# EAGLE design tone (EAGLE 8.5.0)
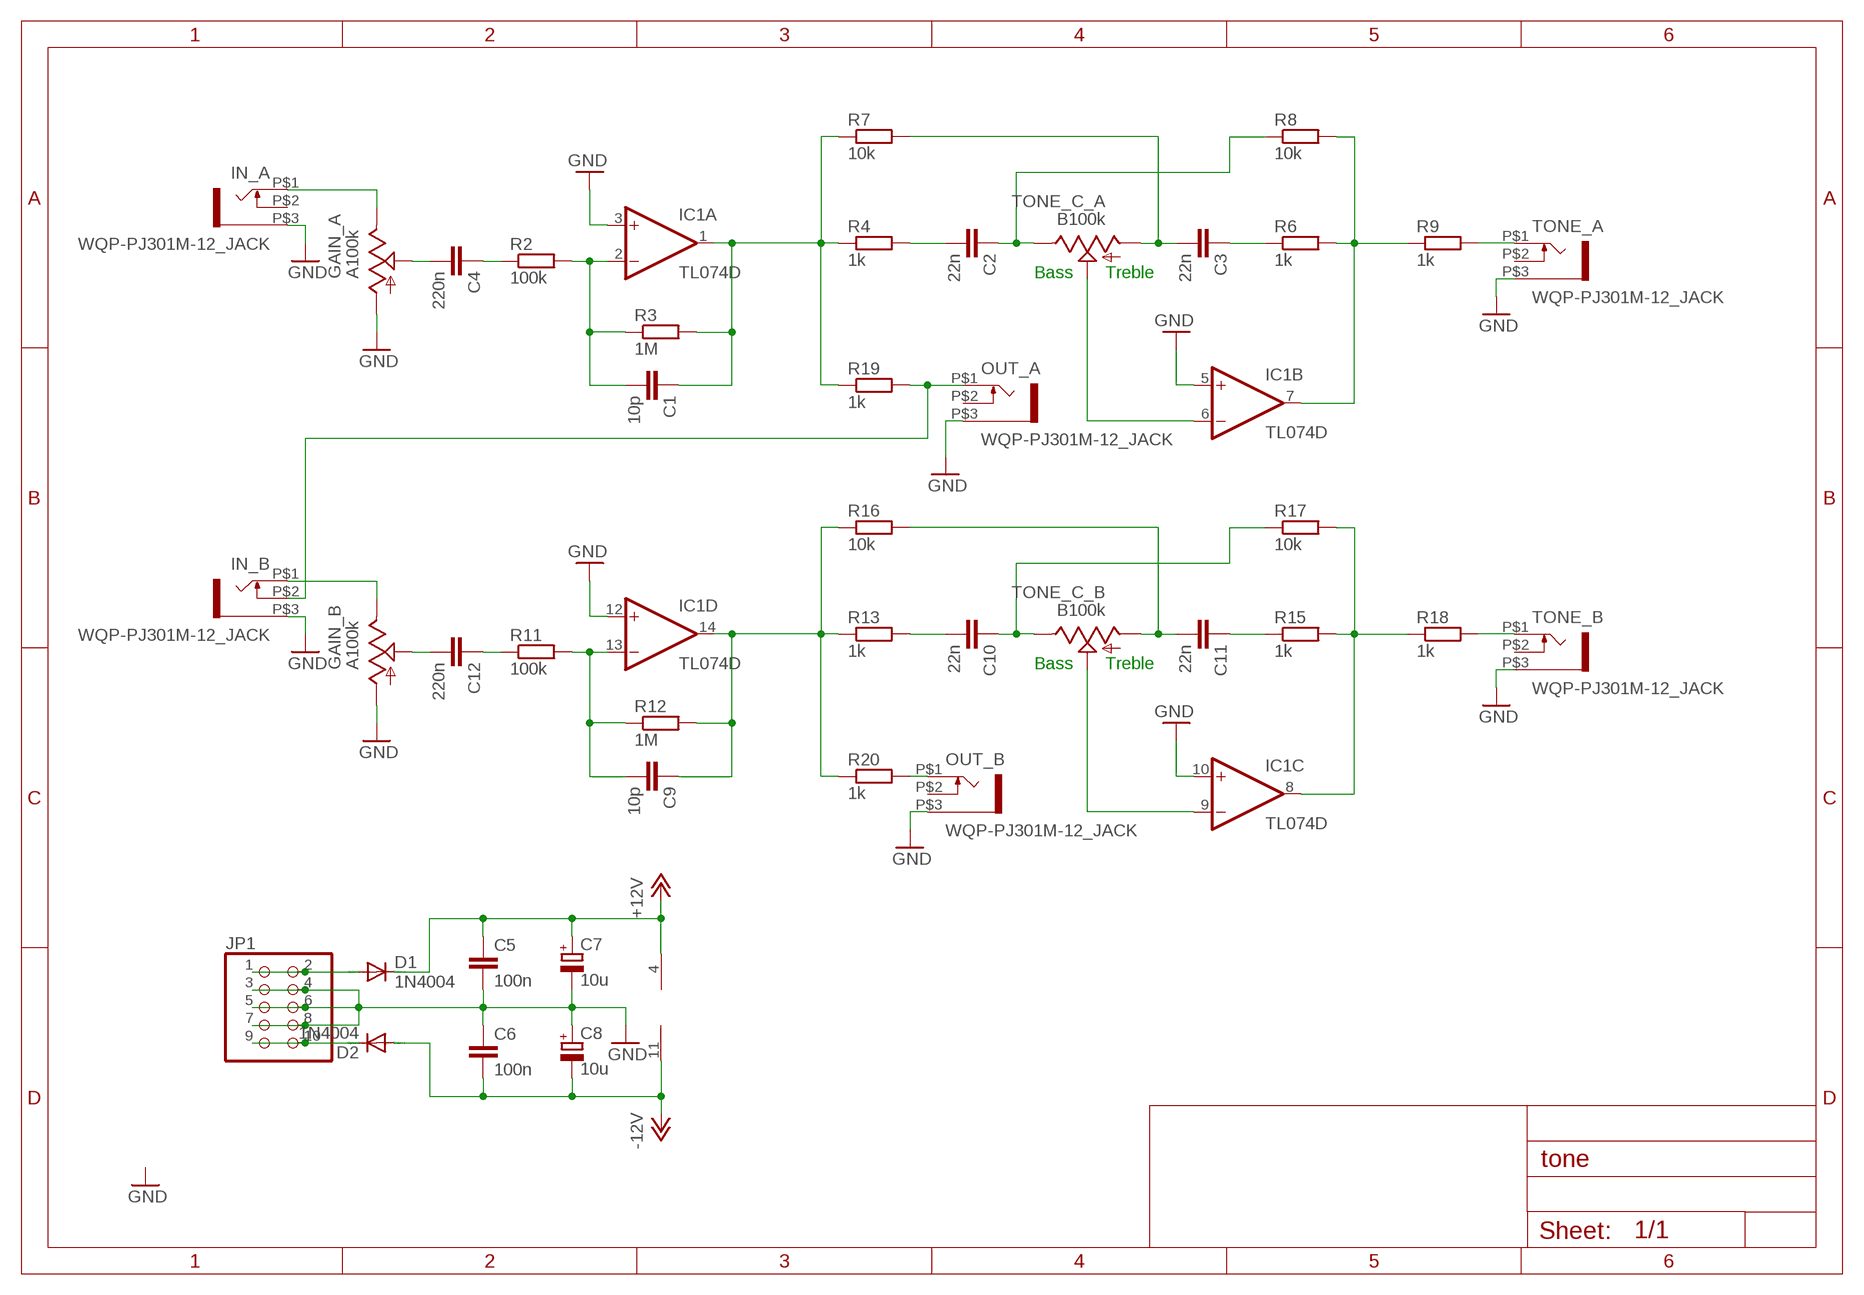
[diagram p0: schematic, sheet 1]

## Parts
C1  10p  C-EUC0603K  [C0603K]
C2  22n  C-EU050-025X075  [C050-025X075]
C3  22n  C-EU050-025X075  [C050-025X075]
C4  220n  C-EU050-025X075  [C050-025X075]
C5  100n  C-EU025-025X050  [C025-025X050]
C6  100n  C-EU025-025X050  [C025-025X050]
C7  10u  CPOL-EUE2.5-6  [E2,5-6]
C8  10u  CPOL-EUE2.5-6  [E2,5-6]
C9  10p  C-EUC0603K  [C0603K]
C10  22n  C-EU050-025X075  [C050-025X075]
C11  22n  C-EU050-025X075  [C050-025X075]
C12  220n  C-EU050-025X075  [C050-025X075]
D1  1N4004  [DO41-10]
D2  1N4004  [DO41-10]
GAIN_A  A100k  POT_USVERTICAL  [ALPS_POT_VERTICAL]
GAIN_B  A100k  POT_USVERTICAL  [ALPS_POT_VERTICAL]
IC1  TL074D  [SO14]
IN_A  WQP-PJ301M-12_JACK  [WQP-PJ301M-12_JACK]
IN_B  WQP-PJ301M-12_JACK  [WQP-PJ301M-12_JACK]
JP1  PINHD-2X5  [2X05]
OUT_A  WQP-PJ301M-12_JACK  [WQP-PJ301M-12_JACK]
OUT_B  WQP-PJ301M-12_JACK  [WQP-PJ301M-12_JACK]
R2  100k  R-EU_R0603  [R0603]
R3  1M  R-EU_R0603  [R0603]
R4  1k  R-EU_R0603  [R0603]
R6  1k  R-EU_R0603  [R0603]
R7  10k  R-EU_R0603  [R0603]
R8  10k  R-EU_R0603  [R0603]
R9  1k  R-EU_R0603  [R0603]
R11  100k  R-EU_R0603  [R0603]
R12  1M  R-EU_R0603  [R0603]
R13  1k  R-EU_R0603  [R0603]
R15  1k  R-EU_R0603  [R0603]
R16  10k  R-EU_R0603  [R0603]
R17  10k  R-EU_R0603  [R0603]
R18  1k  R-EU_R0603  [R0603]
R19  1k  R-EU_R0603  [R0603]
R20  1k  R-EU_R0603  [R0603]
TONE_A  WQP-PJ301M-12_JACK  [WQP-PJ301M-12_JACK]
TONE_B  WQP-PJ301M-12_JACK  [WQP-PJ301M-12_JACK]
TONE_C_A  B100k  POT_USVERTICAL  [ALPS_POT_VERTICAL]
TONE_C_B  B100k  POT_USVERTICAL  [ALPS_POT_VERTICAL]

## Nets
+12V: C5.1 C7.+ D1.C IC1.4(P:V+)
-12V: C6.2 C8.- D2.A IC1.11(P:V-)
GND: C5.2 C6.1 C7.- C8.+ GAIN_A.P$3(A) GAIN_B.P$3(A) IC1.3(A:+IN) IC1.5(B:+IN) IC1.10(C:+IN) IC1.12(D:+IN) IN_A.P$3 IN_B.P$3 JP1.3 JP1.4 JP1.5 JP1.6 JP1.7 JP1.8 OUT_A.P$3 OUT_B.P$3 TONE_A.P$3 TONE_B.P$3
N$1: C1.1 IC1.1(A:OUT) R3.2 R4.1 R7.1 R19.1
N$2: C4.2 GAIN_A.P$2(S)
N$3: C2.2 R4.2
N$4: C2.1 R8.1 TONE_C_A.P$1(E)
N$5: C3.2 R7.2 TONE_C_A.P$3(A)
N$6: C3.1 R6.1
N$7: IC1.7(B:OUT) R6.2 R8.2 R9.1
N$8: C4.1 R2.1
N$9: IC1.6(B:-IN) TONE_C_A.P$2(S)
N$10: C1.2 IC1.2(A:-IN) R2.2 R3.1
N$11: D1.A JP1.1 JP1.2
N$13: GAIN_A.P$1(E) IN_A.P$1
N$15: R9.2 TONE_A.P$1
N$18: D2.C JP1.9 JP1.10
N$20: C9.1 IC1.14(D:OUT) R12.2 R13.1 R16.1 R20.1
N$21: C10.2 R13.2
N$22: C10.1 R17.1 TONE_C_B.P$1(E)
N$23: C11.2 R16.2 TONE_C_B.P$3(A)
N$24: C11.1 R15.1
N$25: IC1.8(C:OUT) R15.2 R17.2 R18.1
N$26: C9.2 IC1.13(D:-IN) R11.2 R12.1
N$27: C12.2 GAIN_B.P$2(S)
N$28: C12.1 R11.1
N$29: GAIN_B.P$1(E) IN_B.P$1
N$30: R18.2 TONE_B.P$1
N$31: IC1.9(C:-IN) TONE_C_B.P$2(S)
N$32: IN_B.P$2 OUT_A.P$1 R19.2
N$33: OUT_B.P$1 R20.2
Unconnected: IN_A.P$2 OUT_A.P$2 OUT_B.P$2 TONE_A.P$2 TONE_B.P$2

## Notes on the sheet
- Bass | Treble
- Bass | Treble

## Library data of the parts
C1-C6 C9-C12 = rcl:C-EU: CAPACITOR, European symbol; SPICEPREFIX: C
C7 C8 = rcl:CPOL-EU: POLARIZED CAPACITOR, European symbol; SPICEPREFIX: C
D1 D2 = diode:1N4004: DIODE general purpose rectifier, 1 A
GAIN_A GAIN_B TONE_C_A TONE_C_B = pot-alps:POT_US
IC1 = linear:TL074: OP AMP
IN_A IN_B OUT_A OUT_B TONE_A TONE_B = thonkiconn:WQP-PJ301M-12_JACK
JP1 = pinhead:PINHD-2X5: PIN HEADER
R2-R4 R6-R9 R11-R13 R15-R20 = rcl:R-EU_: RESISTOR, European symbol

## Board
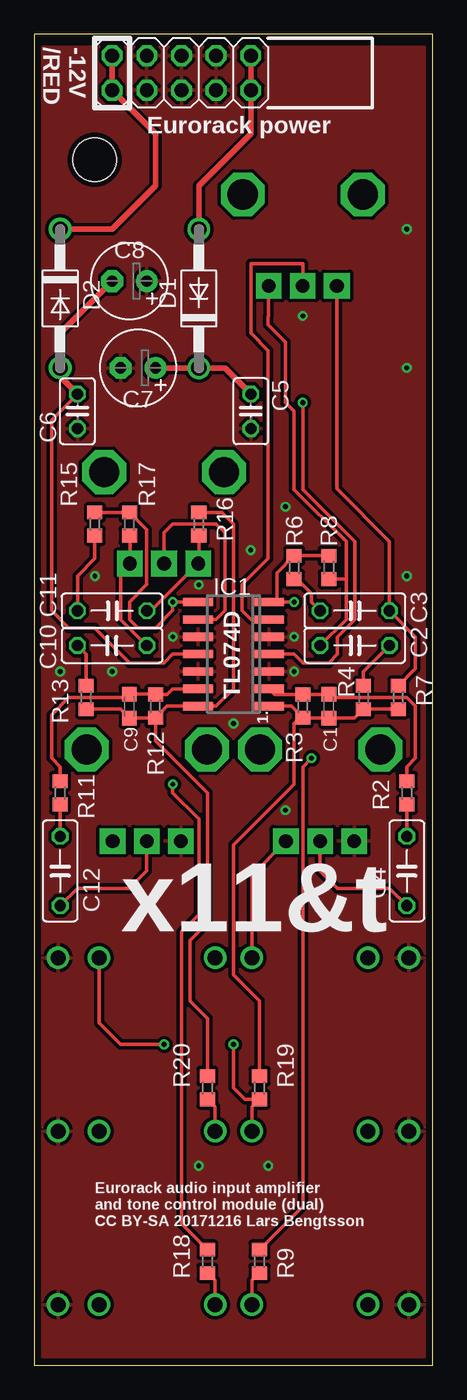
[diagram p1: board, top side]
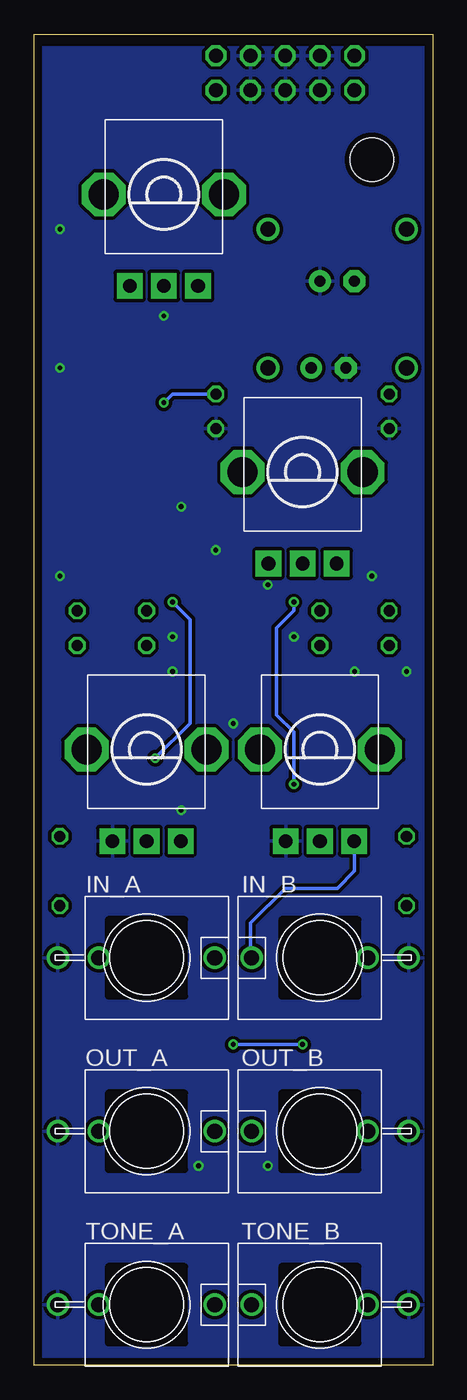
[diagram p2: board, bottom side, seen from below]

Size 29.19 x 97.46 mm. Coordinates in mm from the lower left corner, seen from the top.
Outline: 0,0 29.19,0 29.19,97.46 0,97.46 0,0
Copper layers (1*16): Top 0.0356mm / dielectric 1.5011mm / Bottom 0.0356mm
Design rules "Laen OSH Park PCBOrder": minimum track width 6mil, minimum drill 13mil, track to track 6mil, track to pad 6mil, pad to pad 6mil, via to via 6mil, smd to smd 6mil, copper to edge 15mil, drill to drill 6mil, minimum pad ring 7mil, minimum via ring 7mil, stop-mask expansion 3mil, vias tented up to drill 0mil, thermal gap 10mil
Holes 3.2 mm at 4.45,88.27

### Footprints (pad centres in the part's own frame; a part is rotated, then mirrored left to right if it is on the bottom)
C0603K = smd 1.05 x 1.08: 1 -0.875,0; 2 0.875,0
C050-025X075 = drill 0.813 octagon: 1 -2.54,0; 2 2.54,0
C025-025X050 = drill 0.813 octagon: 1 -1.27,0; 2 1.27,0
E2,5-6 = drill 0.813 pad 1.6: + -1.27,0 | drill 0.813 pad 1.6 octagon: - 1.27,0
DO41-10 = drill 1.118: A 5.08,0; C -5.08,0
ALPS_POT_VERTICAL = drill 1 pad 1.88 square: P$1 -2.5,6.7; P$2 0,6.7; P$3 2.5,6.7 | drill 2.2 pad 3.175 octagon: P$4 -4.4,0; P$5 4.4,0
SO14 = smd 0.6 x 2.2: 1 -3.81,-2.6; 2 -2.54,-2.6; 3 -1.27,-2.6; 4 0,-2.6; 5 1.27,-2.6; 6 2.54,-2.6; 7 3.81,-2.6; 8 3.81,2.6; 9 2.54,2.6; 10 1.27,2.6; 11 0,2.6; 12 -1.27,2.6; 13 -2.54,2.6; 14 -3.81,2.6
WQP-PJ301M-12_JACK = drill 1.1: P$1 0,5; P$2 0,-3.5; P$3 0,-6.5
2X05 = drill 1.016 octagon: 1 -5.08,-1.27; 2 -5.08,1.27; 3 -2.54,-1.27; 4 -2.54,1.27; 5 0,-1.27; 6 0,1.27; 7 2.54,-1.27; 8 2.54,1.27; 9 5.08,-1.27; 10 5.08,1.27
R0603 = smd 1 x 1.1: 1 -0.85,0; 2 0.85,0

### Placement (x,y rotation side)
C1  21.59,48.26 90 top
C2  23.49,52.71 0 top
C3  23.49,55.25 0 top
C4  27.3,36.2 270 top
C5  15.88,69.85 270 top
C6  3.17,69.85 90 top
C7  7.62,73.02 180 top
C8  6.99,79.38 180 top
C9  6.99,48.26 90 top
C10  5.71,52.71 180 top
C11  5.71,55.25 0 top
C12  1.91,36.2 270 top
D1  12.06,78.1 90 top
D2  1.91,78.1 270 top
GAIN_A  20.95,45.09 180 bottom
GAIN_B  8.26,45.09 180 bottom
IC1  14.61,52.07 90 top
IN_A  20.95,29.84 270 bottom
IN_B  8.26,29.84 90 bottom
JP1  10.79,94.61 180 top
OUT_A  20.95,17.14 270 bottom
OUT_B  8.26,17.14 90 bottom
R2  27.3,41.91 90 top
R3  19.68,48.26 270 top
R4  24.13,48.9 90 top
R6  19.05,58.42 90 top
R7  26.67,48.9 90 top
R8  21.59,58.42 90 top
R9  16.51,7.62 270 top
R11  1.91,41.91 90 top
R12  8.89,48.26 270 top
R13  3.81,48.9 90 top
R15  4.45,61.59 90 top
R16  12.06,61.59 270 top
R17  6.99,61.59 90 top
R18  12.7,7.62 270 top
R19  16.51,20.32 270 top
R20  12.7,20.32 270 top
TONE_A  20.95,4.45 270 bottom
TONE_B  8.26,4.45 90 bottom
TONE_C_A  19.68,85.72 180 bottom
TONE_C_B  9.53,65.41 180 bottom

### Tracks (layer width: path | path; a pad name or v marks a point on that pad's centre or on a via)
+12V  (via drill 0.35)
  Top 0.254: IC1.4 19.05,52.07 19.68,51.44 21.59,51.44 22.22,52.07 22.22,53.34 23.49,54.61 23.49,60.33 19.68,64.13 v19.68,70.48
  Top 0.406: C5.1 13.97,73.02 D1.C C7.+
  Bottom 0.254: C5.1 19.05,71.12 v19.68,70.48
-12V
  Top 0.254: IC1.11 10.16,52.07 9.53,51.44 6.99,51.44 4.45,53.98 2.54,53.98 1.27,55.25 1.27,69.21 C6.2
  Top 0.406: C6.2 1.91,72.39 D2.A 1.91,75.56 C8.-
GND  (via drill 0.35)
  other vias: 4.45,57.79 10.16,53.34 5.71,50.8 12.06,57.15 18.41,62.87 19.68,76.83 18.41,40.64 19.05,50.8 19.05,53.34 14.61,46.99 27.3,83.18 15.88,59.69 27.3,73.02 1.91,50.8 27.3,57.79 17.14,14.61 12.06,14.61
  pour Bottom (isolate 0.254): 0.64,96.52 28.57,96.52 28.57,0.64 0.64,0.64
  pour Top (isolate 0.254): 0.64,96.52 28.57,96.52 28.57,0.64 0.64,0.64
N$1
  Top 0.254: 17.78,48.26 arc73 IC1.1 18.83,48.26 R3.2 | R3.2 21.56,47.41 C1.1 23.47,47.39 R4.1 R7.1 | R19.1 16.51,26.67 14.61,28.57 14.61,38.1 19.05,42.55 19.05,46.99 19.47,47.41 R3.2
N$2
  Top 0.254: C4.2 26.04,34.93 22.22,34.93 20.95,36.2 GAIN_A.P$2
N$3
  Top 0.254: R4.2 24.13,50.8 C2.2
N$4
  Top 0.254: C2.1 22.86,54.61 22.86,57.15 22.86,57.57 | TONE_C_A.P$1 17.18,76.83 | 17.18,76.83 17.18,76.8 | 17.18,76.83 17.14,76.8 17.14,76.2 18.41,74.93 18.41,70.48 19.05,69.85 19.05,64.13 22.86,60.33 22.86,57.57 | R8.1 22.86,57.57
N$5
  Top 0.254: R7.2 27.94,51.02 27.94,53.34 C3.2 26.04,60.33 22.18,64.17 TONE_C_A.P$3
N$6
  Top 0.254: C3.1 20.32,55.88 20.32,56.52 19.26,57.57 R6.1
N$7  (via drill 0.35)
  Top 0.254: R9.1 19.68,11.64 19.68,43.82 v20.32,44.45 | IC1.7 17.78,55.88 | 17.78,55.88 v19.05,55.88 | R8.2 R6.2 17.78,58 17.78,55.88
  Bottom 0.254: v19.05,55.88 17.78,54.61 17.78,46.99 v20.32,44.45
N$8
  Top 0.254: C4.1 R2.1
N$9
  Top 0.254: IC1.6 15.88,54.61 15.24,55.25 15.24,57.15 17.14,59.05 17.14,74.3 15.88,75.56 15.88,80.64 19.68,80.64 TONE_C_A.P$2
N$10
  Top 0.254: R2.2 27.3,43.82 27.94,44.45 27.94,48.26 27.3,48.9 21.83,48.9 C1.2 21.56,49.11 R3.1 17.62,49.11 IC1.2
N$11
  Top 0.406: D1.A 12.06,86.36 15.88,90.17 JP1.2 JP1.1
N$13
  Top 0.254: IN_A.P$1 15.96,35.89 GAIN_A.P$1
N$15
  Top 0.254: TONE_A.P$1 15.96,6.21 R9.2
N$18
  Top 0.406: JP1.9 JP1.10 8.89,90.17 8.89,86.36 5.71,83.18 D2.C
N$20
  Top 0.254: R12.2 7.01,47.41 C9.1 6.33,48.05 R13.1 | R12.2 9.74,48.26 IC1.14 13.34,48.26 14.61,49.53 14.61,59.05 14.61,59.27 14.61,61.59 13.76,62.45 R16.1 | R20.1 12.7,25.4 11.43,26.67 11.43,31.11 12.7,32.39 12.7,41.91 8.89,45.72 R12.2
N$21
  Top 0.254: C10.2 3.81,52.07 R13.2
N$22
  Top 0.254: C10.1 6.35,54.61 6.35,58.03 TONE_C_B.P$1 7.03,60.71 R17.1
N$23
  Top 0.254: C11.2 8.56,55.25 TONE_C_B.P$3 12.06,58.75 R16.2
N$24
  Top 0.254: R15.1 4.45,59.05 3.17,57.79 C11.1
N$25  (via drill 0.35)
  Top 0.254: IC1.8 v10.16,55.88 10.16,55.25 8.89,53.98 7.62,53.98 6.99,54.61 6.99,55.88 8.26,57.15 8.26,61.18 R17.2 R15.2 | v10.16,42.55 10.16,41.91 12.06,40.01 12.06,33.02 10.79,31.75 10.79,10.38 R18.1
  Bottom 0.254: v10.16,55.88 10.16,55.25 11.43,53.98 11.43,47.62 10.16,46.36 v10.16,42.55
N$26
  Top 0.254: IC1.13 10.16,49.53 9.74,49.11 R12.1 8.87,49.14 C9.2 6.75,48.9 2.54,48.9 1.27,47.62 1.27,44.45 1.91,43.82 R11.2
N$27
  Top 0.254: C12.2 3.17,34.93 6.99,34.93 8.26,36.2 GAIN_B.P$2
N$28
  Top 0.254: R11.1 C12.1
N$29
  Bottom 0.254: IN_B.P$1 13.34,29.92 13.34,32.39 10.79,34.93 6.99,34.93 5.71,36.2 5.71,38.34 GAIN_B.P$1
N$30
  Top 0.254: TONE_B.P$1 13.26,6.21 R18.2
N$31
  Top 0.254: IC1.9 13.34,54.61 13.97,55.25 13.97,60.96 13.34,61.59 10.16,61.59 9.53,60.96 TONE_C_B.P$2
N$32  (via drill 0.35)
  Top 0.254: OUT_A.P$1 15.96,18.91 R19.2 15.46,19.47 14.61,20.32 v14.61,23.49 | IN_B.P$2 4.75,25.09 6.35,23.49 v9.53,23.49
  Bottom 0.254: v9.53,23.49 v14.61,23.49
N$33
  Top 0.254: OUT_B.P$1 13.26,18.91 R20.2

### Text on the board
tPlace: -12V / /RED | Eurorack power | 1. | x11&t | Eurorack audio input amplifier / and tone control module (dual) / CC BY-SA 20171216 Lars Bengtsson